# EAGLE design bt-snes-aa-ncp1402-letter-select-attiny25 (EAGLE 6.1)
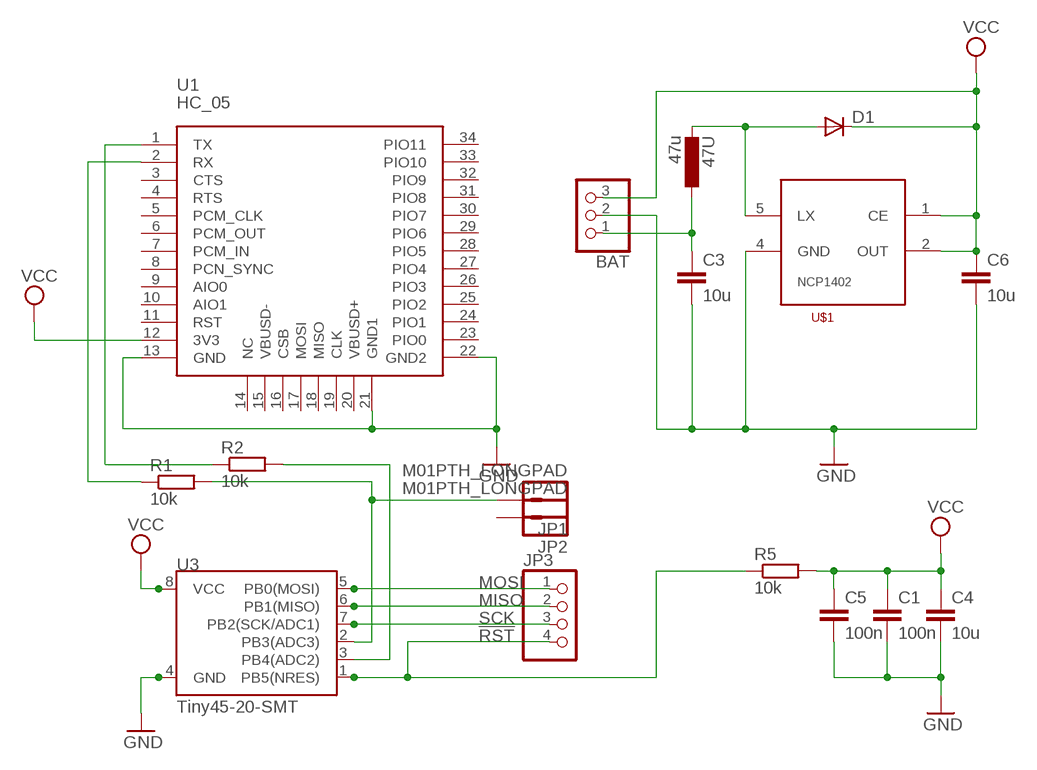
[diagram p0: schematic, sheet 1]

## Parts
47U  47u  L-EUL1210  [C1210]
BAT  PINHD-1X3  [1X03]
C1  100n  C-EUC0805K  [C0805K]
C3  10u  C-EUC0805K  [C0805K]
C4  10u  C-EUC0805K  [C0805K]
C5  100n  C-EUC0805K  [C0805K]
C6  10u  C-EUC0805K  [C0805K]
D1  DIODE-SOD80C  [SOD80C]
JP1  M01PTH_LONGPAD  [1X01_LONGPAD]
JP2  M01PTH_LONGPAD  [1X01_LONGPAD]
JP3  PINHD-1X4  [1X04]
R1  10k  R-EU_M0805  [M0805]
R2  10k  R-EU_M0805  [M0805]
R5  10k  R-EU_M0805  [M0805]
U1  HC_05  [BLUETOOTH_SMD]
U3  Tiny45-20-SMT  ATTINY45TINY45-20-SMT  [SO08-EIAJ]
U$1  NCP1402-SOT23-5  [SOT23-5]

## Nets
!RST: JP3.4 R5.1 U3.1(PB5(NRES))
GND: BAT.2 C1.2 C3.2 C4.2 C5.2 C6.2 U1.13(GND) U1.21(GND1) U1.22(GND2) U3.4(GND) U$1.4(GND)
MISO: JP3.2 U3.6(PB1(MISO))
MOSI: JP3.1 U3.5(PB0(MOSI))
N$1: R2.2 U3.3(PB4(ADC2))
N$2: R1.1 U1.2(RX)
N$3: JP1.1 R1.2 U3.2(PB3(ADC3))
N$5: R2.1 U1.1(TX)
N$13: 47U.1 BAT.1 C3.1
N$14: 47U.2 D1.A U$1.5(LX)
SCK: JP3.3 U3.7(PB2(SCK/ADC1))
VCC: BAT.3 C1.1 C4.1 C5.1 C6.1 D1.C R5.2 U1.12(3V3) U3.8(VCC) U$1.1(CE) U$1.2(OUT)
Unconnected: JP2.1 U1.3(CTS) U1.4(RTS) U1.5(PCM_CLK) U1.6(PCM_OUT) U1.7(PCM_IN) U1.8(PCN_SYNC) U1.9(AIO0) U1.10(AIO1) U1.11(RST) U1.14(NC) U1.15(VBUSD-) U1.16(CSB) U1.17(MOSI) U1.18(MISO) U1.19(CLK) U1.20(VBUSD+) U1.23(PIO0) U1.24(PIO1) U1.25(PIO2) U1.26(PIO3) U1.27(PIO4) U1.28(PIO5) U1.29(PIO6) U1.30(PIO7) U1.31(PIO8) U1.32(PIO9) U1.33(PIO10) U1.34(PIO11)

## Library data of the parts
47U = _MY_OWN_LIB:L-EU: INDUCTOR, European symbol
BAT = pinhead:PINHD-1X3: PIN HEADER
C1 C3-C6 = rcl:C-EU: CAPACITOR, European symbol
D1 = diode:DIODE-: DIODE
JP1 JP2 = _MY_OWN_LIB:M01: Header 1 Standard 1-pin 0.1" header. Use with straight break away headers (SKU : PRT-00116), right angle break away headers (PRT-00553), swiss pins (PRT-00743), machine pins (PRT-00117), and female headers (PRT-00115).
JP3 = pinhead:PINHD-1X4: PIN HEADER
R1 R2 R5 = rcl:R-EU_: RESISTOR, European symbol
U1 = SerialPortBluetooth:HC_05
U3 = SparkFun-DigitalIC:ATTINY45: Atmel 8-pin 2/4/8kB flash uC; PROD_ID: IC-08922
U$1 = _MY_OWN_LIB:NCP1402

## Board
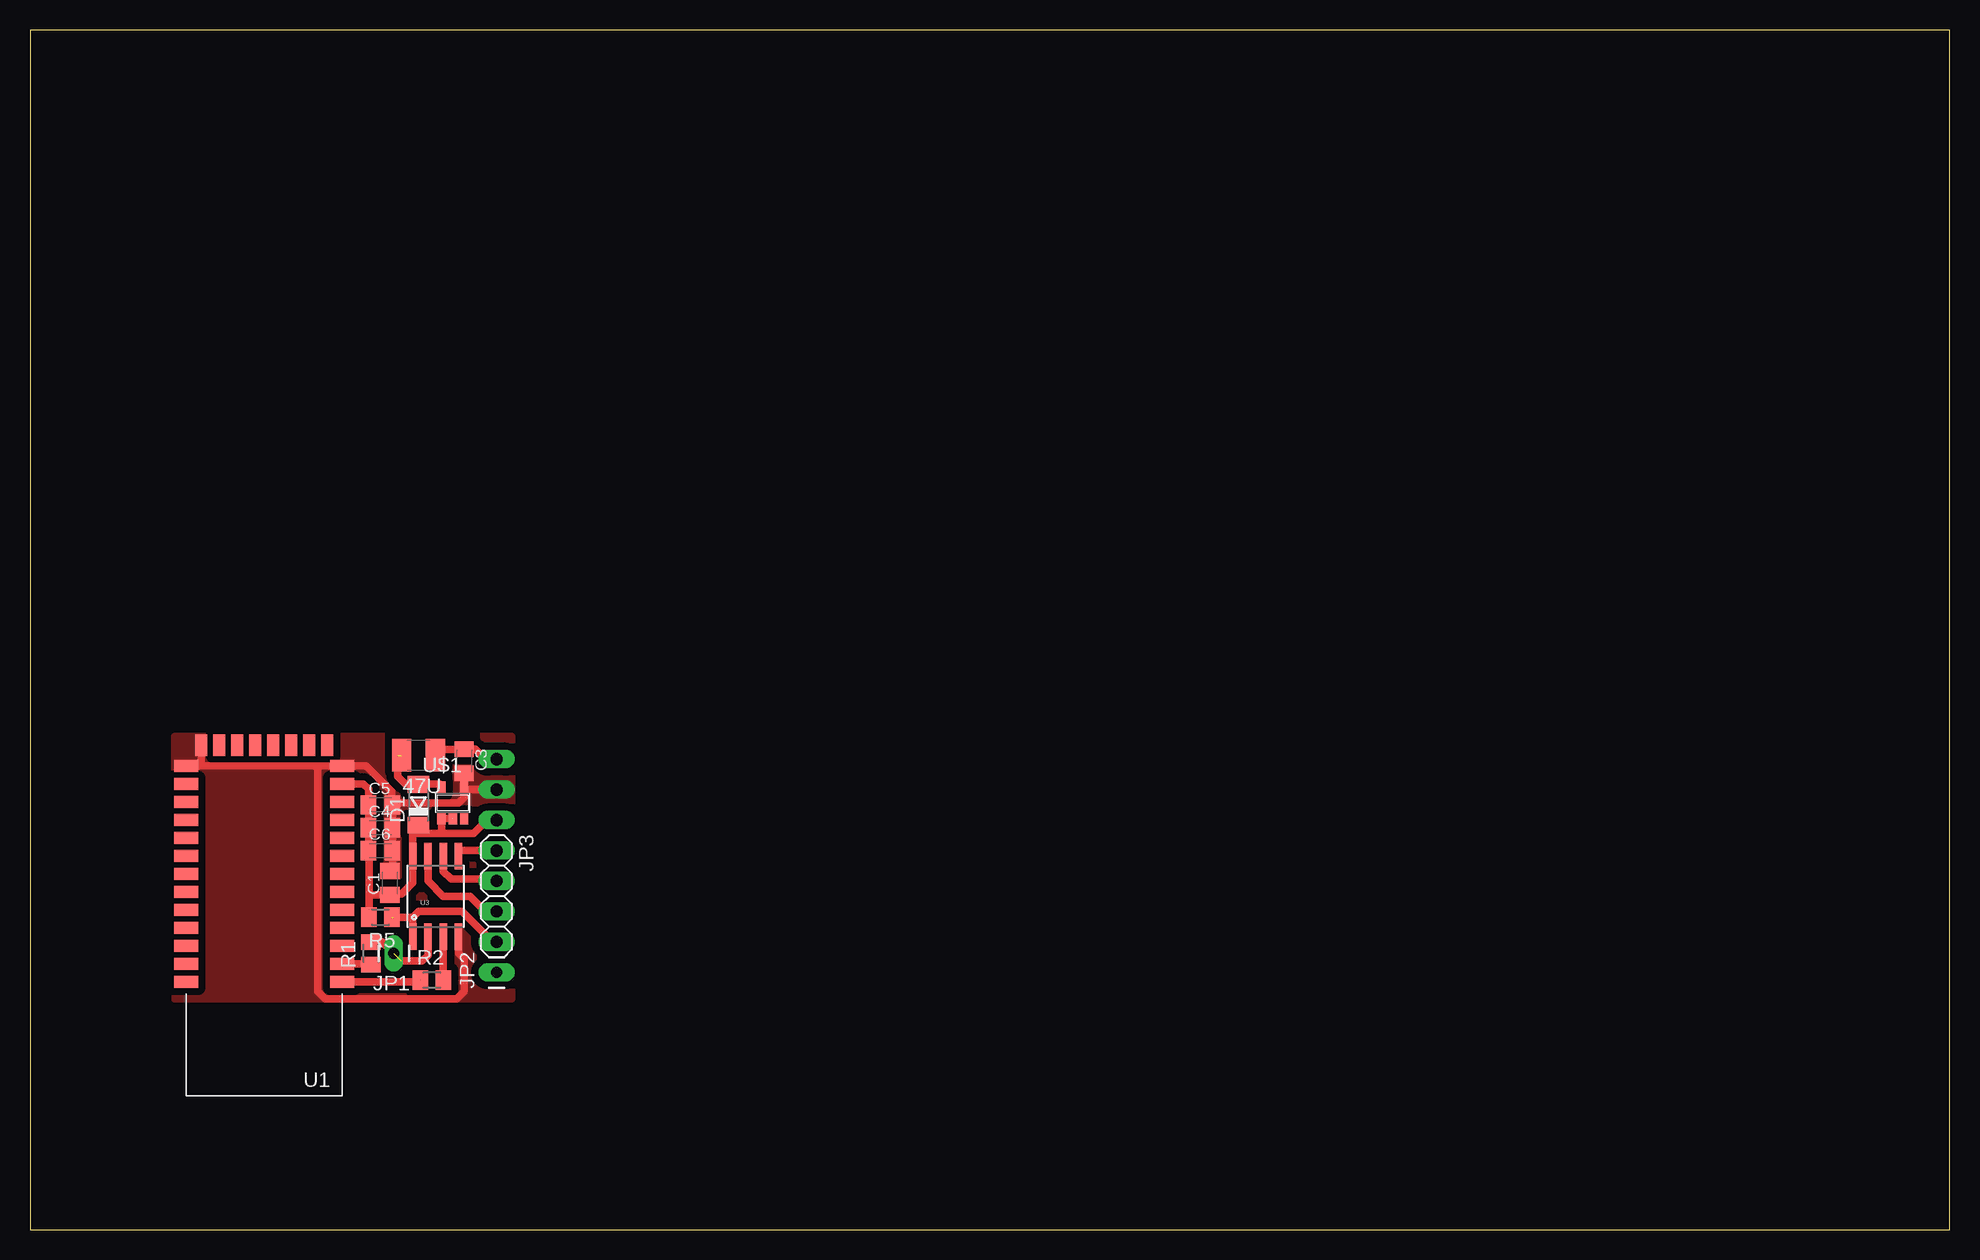
[diagram p1: board, top side]
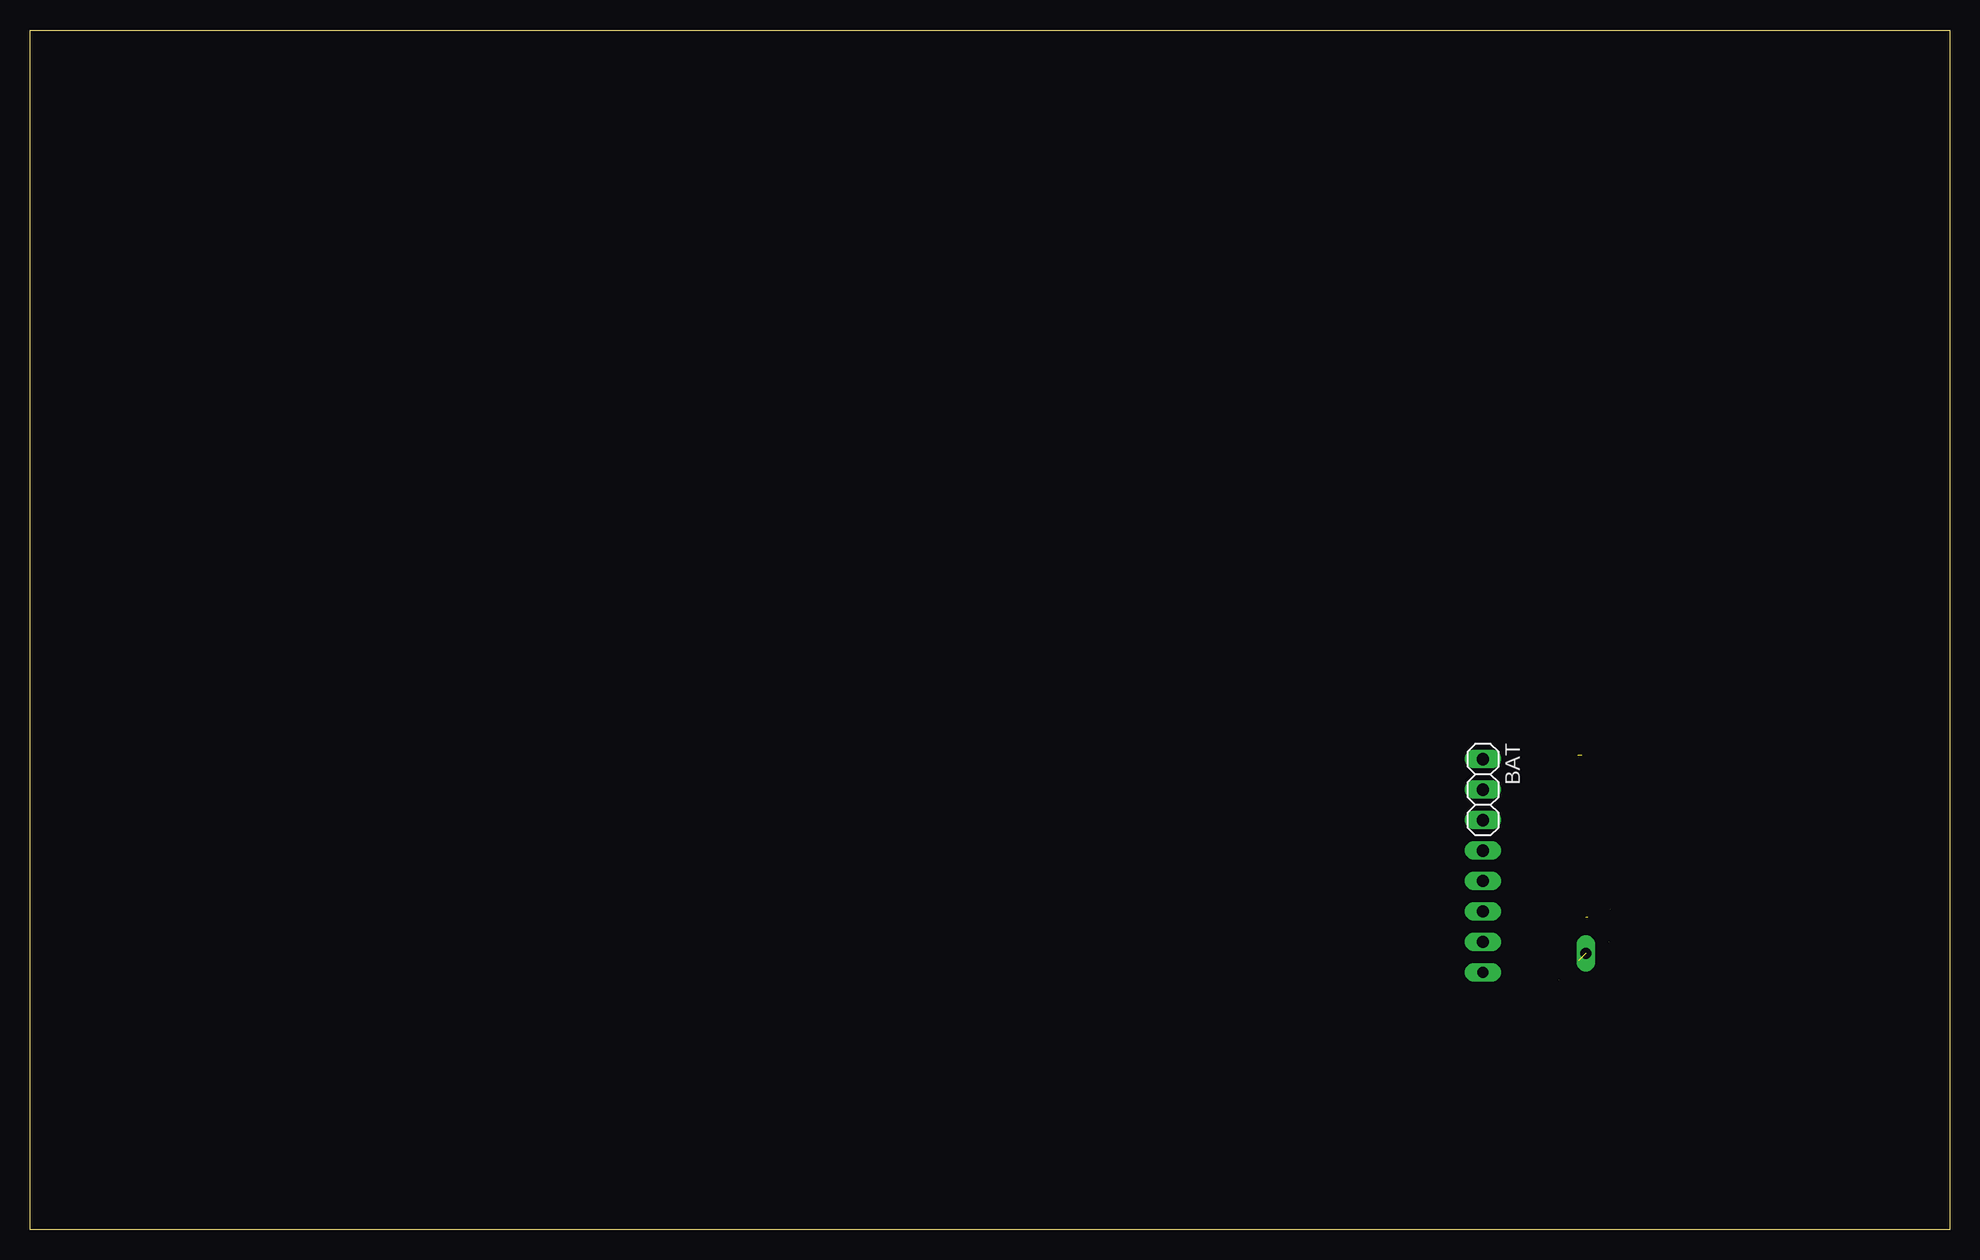
[diagram p2: board, bottom side, seen from below]

Size 160 x 100 mm. Coordinates in mm from the lower left corner, seen from the top.
Outline: 0,0 160,0 160,100 0,100 0,0
Copper layers (1*16): Top 0.035mm / dielectric 1.5mm / Bottom 0.035mm
Design rules: minimum track width 10mil, minimum drill 24mil, track to track 8mil, track to pad 8mil, pad to pad 8mil, via to via 8mil, smd to smd 8mil, copper to edge 40mil, drill to drill 8mil, minimum pad ring 10mil, minimum via ring 8mil, stop-mask expansion 4mil, vias tented up to drill 0mil, thermal gap 10mil

### Footprints (pad centres in the part's own frame; a part is rotated, then mirrored left to right if it is on the bottom)
C1210 = smd 1.6 x 2.7: 1 -1.4,0; 2 1.4,0
1X03 = drill 1.016 long: 1 -2.54,0; 2 0,0; 3 2.54,0
C0805K = smd 1.3 x 1.6: 1 -1,0; 2 1,0
SOD80C = smd 1.4 x 1.8: A 1.7,0; C -1.7,0
1X01_LONGPAD = drill 0.9 pad 1.524 long: 1 0,0
1X04 = drill 1.016 long: 1 -3.81,0; 2 -1.27,0; 3 1.27,0; 4 3.81,0
M0805 = smd 1.3 x 1.6: 1 -0.95,0; 2 0.95,0
BLUETOOTH_SMD = smd 2 x 1: 1 0,0; 2 0,-1.5; 3 0,-3; 4 0,-4.5; 5 0,-6; 6 0,-7.5; 7 0,-9; 8 0,-10.5; 9 0,-12; 10 0,-13.5; 11 0,-15; 12 0,-16.5; 13 0,-18; 22 13,-18; 23 13,-16.5; 24 13,-15; 25 13,-13.5; 26 13,-12; 27 13,-10.5; 28 13,-9; 29 13,-7.5; 30 13,-6; 31 13,-4.5; 32 13,-3; 33 13,-1.5; 34 13,0 | smd 1 x 1.8: 14 1.25,-19.75; 15 2.75,-19.75; 16 4.25,-19.75; 17 5.75,-19.75; 18 7.25,-19.75; 19 8.75,-19.75; 20 10.25,-19.75; 21 11.75,-19.75
SO08-EIAJ = smd 0.61 x 2.21: 1 -1.905,-3.378; 2 -0.635,-3.378; 3 0.635,-3.378; 4 1.905,-3.378; 5 1.905,3.353; 6 0.635,3.353; 7 -0.635,3.353; 8 -1.905,3.353
SOT23-5 = smd 0.69 x 0.99: 1 -0.95,-1.29; 2 0,-1.29; 3 0.95,-1.29; 4 0.95,1.3; 5 -0.95,1.3

### Placement (x,y rotation side)
47U  32.38,39.53 180 top
BAT  38.89,36.67 270 bottom
C1  30,28.89 90 top
C3  36.2,39.05 270 top
C4  29.21,33.5 0 top
C5  29.21,35.4 0 top
C6  29.21,31.59 0 top
D1  32.38,35.4 90 top
JP1  30.32,23.02 180 top
JP2  38.89,21.43 90 top
JP3  38.89,27.78 270 top
R1  28.42,23.02 90 top
R2  33.5,20.8 0 top
R5  29.21,26.04 180 top
U1  26.04,20.64 180 top
U3  33.81,27.78 0 top
U$1  35.24,35.56 0 top

### Tracks (layer width: path | path; a pad name or v marks a point on that pad's centre or on a via)
!RST  (1 unrouted)
  Top 0.61: 30.32,26.04 31.91,26.04 | U3.1 31.91,26.04 | 31.91,26.04 32.38,26.51 36.04,26.51 38.58,23.97 JP3.4
GND
  Top 0.61: U1.22 14.13,38.64 | 14.13,38.64 23.97,38.64 | 23.97,38.64 U1.13 28.04,38.64 30.16,36.51 30.16,35.4 30.21,35.35 C6.2 | U1.21 14.29,38.79 14.13,38.64 | C6.2 C4.2 C5.2 30.37,35.56 35.72,35.56 36.2,36.04 U$1.4 | 23.97,38.64 23.97,19.84 24.61,19.21 35.56,19.21 36.2,19.84 36.2,22.54 35.72,23.02 35.72,24.29 | U$1.4 36.19,37.74 C3.2 | BAT.2 36.38,36.67 U$1.4 | C6.2 30.21,29.89 30,29.69
  pour Top (isolate 0.61, no thermals): 12.06,41.12 40.16,41.12 40.16,19.21 12.06,19.21
MISO
  Top 0.61: U3.6 34.45,29.84 35.08,29.21 38.73,29.21 JP3.2
MOSI
  Top 0.61: U3.5 35.72,31.59 JP3.1
N$1
  Top 0.61: U3.3 R2.2
N$2
  Top 0.61: U1.2 28.19,22.14 R1.1
N$3  (2 unrouted)
  Top 0.61: U3.2 33.18,22.86 32.7,22.38 30.96,22.38 29.37,23.97 R1.2
N$5  (1 unrouted)
  Top 0.61: U1.1 32.38,20.64 R2.1
N$13
  Top 0.61: 47U.1 33.47,39.66 33.81,40.01 35.83,40.01 C3.1 37.1,40.05 37.94,39.21 BAT.1
N$14  (1 unrouted)
  Top 0.61: 32.57,37.13 D1.A 32.59,37.15 | U$1.5 34.29,36.99 34.13,37.15 32.59,37.15 | 32.59,37.15 31.27,37.15 30.64,37.78 30.64,39.53
SCK
  Top 0.61: U3.7 33.18,29.05 34.45,27.78 36.67,27.78 37.94,26.51 JP3.3
VCC  (1 unrouted)
  Top 0.61: 33.07,33.02 34.29,33.02 | 33.07,33.02 31.91,33.02 U3.8 31.91,28.89 30.98,27.97 30.08,27.97 C1.1 28.31,27.89 28.26,27.62 | 33.07,33.02 D1.C | 34.29,33.02 U$1.1 U$1.2 | R5.2 28.26,26.67 | U1.12 27.79,37.14 28.21,36.72 C5.1 C4.1 C6.1 28.26,31.54 28.26,27.62 | 34.29,33.02 36.99,33.02 38.1,34.13 BAT.3 | 28.26,27.62 28.26,26.67